# EAGLE design CHAIRI2CXIAO (EAGLE 9.6.2)

## Sheet 1 of 2
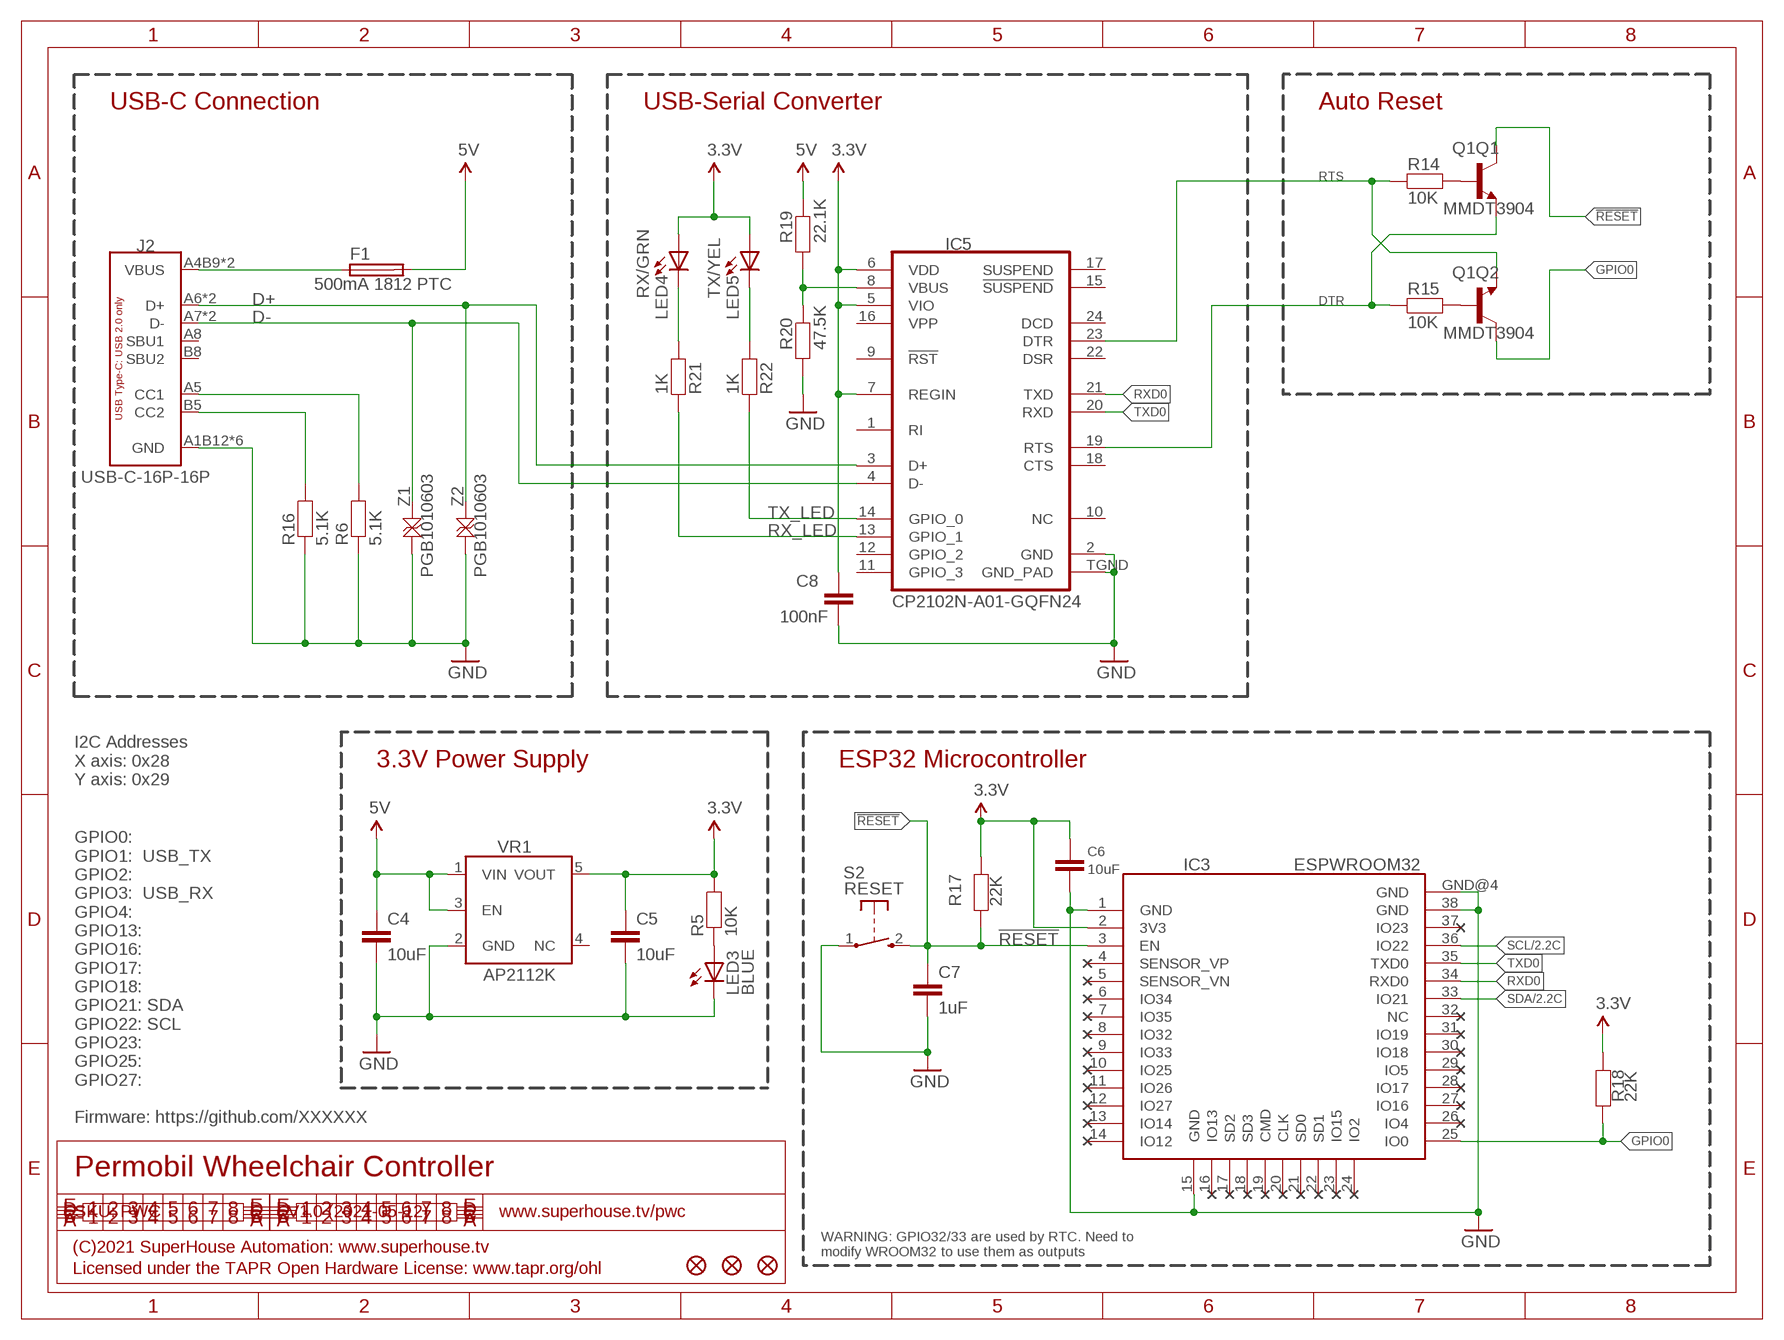
[diagram p0: schematic, sheet 1]

### Parts
C4  10uF  CAP0805  [C0805]
C5  10uF  CAP0805  [C0805]
C6  10uF  CAP0805  [C0805]
C7  1uF  CAP0603  [C0603]
C8  100nF  CAP0603  [C0603]
F1  500mA 1812 PTC  PTC050  [1812]
IC3  ESPWROOM32  [ESPWROOM32]
IC5  CP2102N-A01-GQFN24  CP2104  [QFN-24]
J2  USB-C-16P-16P  [USB-C-16P]
LED3  BLUE  LED0603  [LED-0603]
LED4  RX/GRN  LED0603  [LED-0603]
LED5  TX/YEL  LED0603  [LED-0603]
Q1  MMDT3904  TRANS_NPN_DUAL-MMDT3904  [SOT-363]
R5  10K  RESISTOR0603  [R0603]
R6  5.1K  RESISTOR0603  [R0603]
R14  10K  RESISTOR0603  [R0603]
R15  10K  RESISTOR0603  [R0603]
R16  5.1K  RESISTOR0603  [R0603]
R17  22K  RESISTOR0603  [R0603]
R18  22K  RESISTOR0603  [R0603]
R19  22.1K  RESISTOR0603  [R0603]
R20  47.5K  RESISTOR0603  [R0603]
R21  1K  RESISTOR0603  [R0603]
R22  1K  RESISTOR0603  [R0603]
S2  RESET  TAC_SWITCH_2PINSMT  [TACTILE_SMT_3X4X2]
U$35  FIDUCIAL1X2  [FIDUCIAL-1X2]
U$36  FIDUCIAL1X2  [FIDUCIAL-1X2]
U$37  FIDUCIAL1X2  [FIDUCIAL-1X2]
VR1  AP2112KSOT25  [SOT23-5]
Z1  PGB1010603  TVS0603  [TVS0603]
Z2  PGB1010603  TVS0603  [TVS0603]

### Nets
3.3V: C5.1 C6.1 C8.1 IC3.2(3V3) IC5.5(VIO) IC5.6(VDD) IC5.7(REGIN) LED4.A LED5.A R5.2 R17.1 R18.1 VR1.5(VOUT) ; also sheet 2
5V: C4.1 F1.2 R19.2 VR1.1(VIN) VR1.3(EN)
!RESET: C7.1 IC3.3(EN) Q1.3(Q1:C) R17.2 S2.2(S)
D+: IC5.3(D+) J2.A6(D+) J2.B6(D+) Z2.2
D-: IC5.4(D-) J2.A7(D-) J2.B7(D-) Z1.2
DTR: IC5.23(DTR) Q1.1(Q2:E) R14.1
GND: C4.2 C5.2 C6.2 C7.2 C8.2 IC3.1(GND) IC3.15(GND) IC3.38(GND) IC3.GND@4(GND) IC5.2(GND) IC5.TGND(GND_PAD) J2.A1B12(GND) J2.A12B1(GND) J2.FIX1(GND) J2.FIX2(GND) J2.FIX3(GND) J2.FIX4(GND) LED3.C R6.1 R16.1 R20.1 S2.1(P) VR1.2(GND) Z1.1 Z2.1 ; also sheet 2
GPIO0: IC3.25(IO0) Q1.6(Q2:C) R18.2
N$1: LED3.A R5.1
N$7: Q1.5(Q1:B) R14.2
N$8: Q1.2(Q2:B) R15.2
N$9: LED4.C R21.2
N$10: J2.B5(CC2) R16.2
N$11: J2.A5(CC1) R6.2
N$13: LED5.C R22.2
N$39: IC5.8(VBUS) R19.1 R20.2
RTS: IC5.19(RTS) Q1.4(Q1:E) R15.1
RX_LED: IC5.13(GPIO_1) R21.1
RXD0: IC3.34(RXD0) IC5.21(TXD)
SCL: IC3.36(IO22) ; also sheet 2
SDA: IC3.33(IO21) ; also sheet 2
TX_LED: IC5.14(GPIO_0) R22.1
TXD0: IC3.35(TXD0) IC5.20(RXD)
VIN: F1.1 J2.A4B9(VBUS) J2.A9B4(VBUS)
Unconnected: IC3.4(SENSOR_VP) IC3.5(SENSOR_VN) IC3.6(IO34) IC3.7(IO35) IC3.8(IO32) IC3.9(IO33) IC3.10(IO25) IC3.11(IO26) IC3.12(IO27) IC3.13(IO14) IC3.14(IO12) IC3.16(IO13) IC3.17(SD2) IC3.18(SD3) IC3.19(CMD) IC3.20(CLK) IC3.21(SD0) IC3.22(SD1) IC3.23(IO15) IC3.24(IO2) IC3.26(IO4) IC3.27(IO16) IC3.28(IO17) IC3.29(IO5) IC3.30(IO18) IC3.31(IO19) IC3.32(NC) IC3.37(IO23) IC5.1(RI) IC5.9(!RST) IC5.10(NC) IC5.11(GPIO_3) IC5.12(GPIO_2) IC5.15(!SUSPEND) IC5.16(VPP) IC5.17(SUSPEND) IC5.18(CTS) IC5.22(DSR) IC5.24(DCD) J2.A8(SBU1) J2.B8(SBU2) VR1.4(NC)

### Notes on the sheet
- USB-C Connection | USB-Serial Converter | Auto Reset
- 3.3V Power Supply | ESP32 Microcontroller
- I2C Addresses
  X axis: 0x28
  Y axis: 0x29
- GPIO0:  
  GPIO1:  USB_TX
  GPIO2:  
  GPIO3:  USB_RX
  GPIO4:  
  GPIO13: 
  GPIO16: 
  GPIO17: 
  GPIO18: 
  GPIO21: SDA
  GPIO22: SCL
  GPIO23: 
  GPIO25: 
  GPIO27: 
  
  Firmware: https://github.com/XXXXXX
- Permobil Wheelchair Controller
- SKU: PWC | V1.0 (2021-05-12) | www.superhouse.tv/pwc
- (C)2021 SuperHouse Automation: www.superhouse.tv
- WARNING: GPIO32/33 are used by RTC. Need to
  modify WROOM32 to use them as outputs
- Licensed under the TAPR Open Hardware License: www.tapr.org/ohl

## Sheet 2 of 2
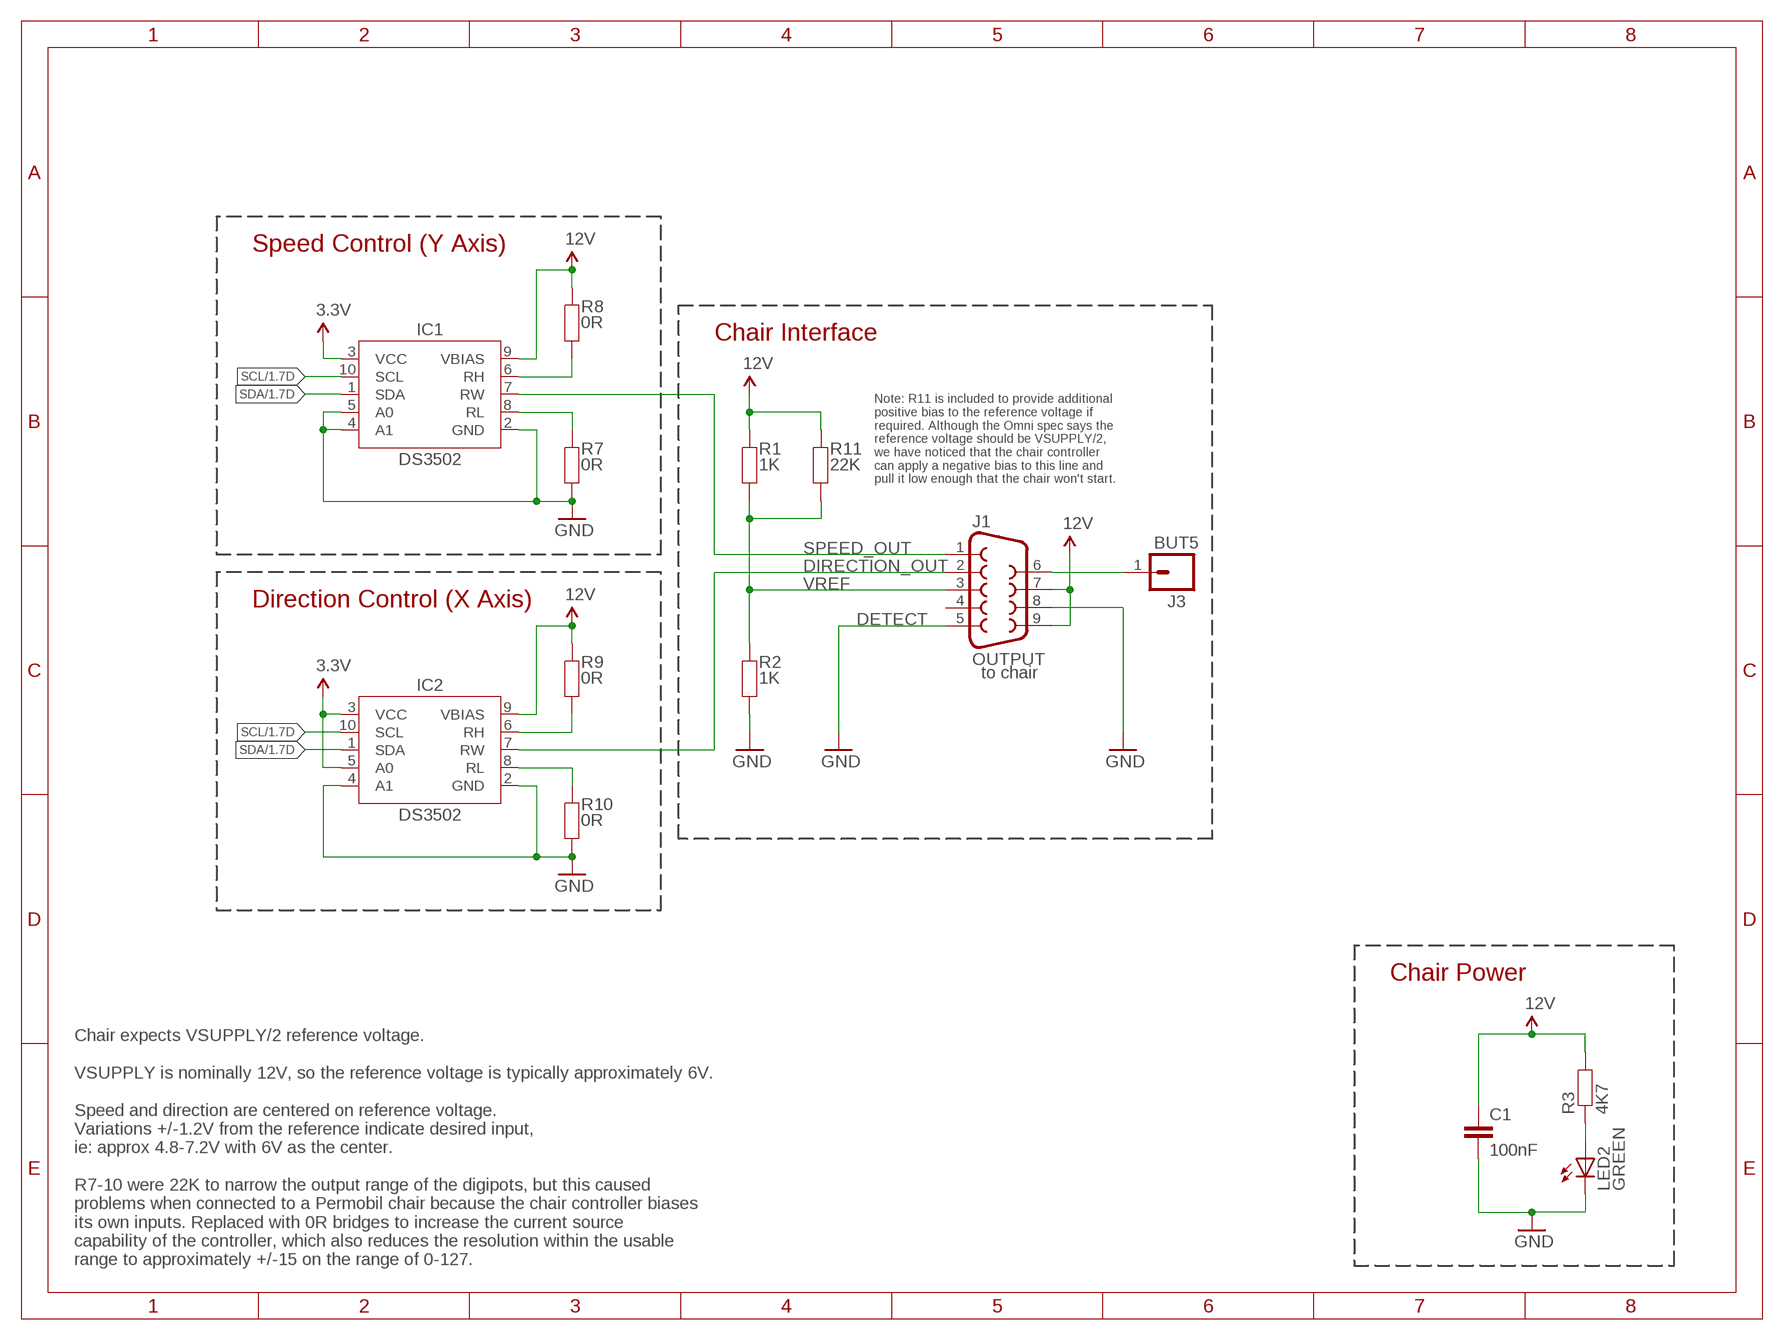
[diagram p1: schematic, sheet 2]

### Parts
C1  100nF  CAP0603  [C0603]
IC1  DS3502  [MSOP10]
IC2  DS3502  [MSOP10]
J1  OUTPUT  DB9-PCB-SOCKET  [DB9-PCB-SOCKET]
J3  BUT5  M01-PLAIN  [1X01]
LED2  GREEN  LED0603  [LED-0603]
R1  1K  RESISTOR0603  [R0603]
R2  1K  RESISTOR0603  [R0603]
R3  4K7  RESISTOR0603  [R0603]
R7  0R  RESISTOR0603  [R0603]
R8  0R  RESISTOR0603  [R0603]
R9  0R  RESISTOR0603  [R0603]
R10  0R  RESISTOR0603  [R0603]
R11  22K  RESISTOR0603  [R0603]

### Nets
3.3V: IC1.3(VCC) IC2.3(VCC) IC2.5(A0) ; also sheet 1
12V: C1.1 IC1.9(VBIAS) IC2.9(VBIAS) J1.7 J1.9 R1.2 R3.2 R8.2 R9.2 R11.2
BUT5: J1.6 J3.1
DIRECTION_OUT: IC2.7(RW) J1.2
GND: C1.2 IC1.2(GND) IC1.4(A1) IC1.5(A0) IC2.2(GND) IC2.4(A1) J1.5 J1.8 LED2.C R2.1 R7.1 R10.1 ; also sheet 1
N$2: IC1.6(RH) R8.1
N$3: IC2.6(RH) R9.1
N$4: IC1.8(RL) R7.2
N$6: LED2.A R3.1
N$15: IC2.8(RL) R10.2
SCL: IC1.10(SCL) IC2.10(SCL) ; also sheet 1
SDA: IC1.1(SDA) IC2.1(SDA) ; also sheet 1
SPEED_OUT: IC1.7(RW) J1.1
VREF: J1.3 R1.1 R2.2 R11.1
Unconnected: J1.4

### Notes on the sheet
- Speed Control (Y Axis)
- Chair Interface
- Note: R11 is included to provide additional
  positive bias to the reference voltage if
  required. Although the Omni spec says the
  reference voltage should be VSUPPLY/2,
  we have noticed that the chair controller
  can apply a negative bias to this line and
  pull it low enough that the chair won't start.
- Direction Control (X Axis)
- DETECT
- to chair
- Chair Power
- Chair expects VSUPPLY/2 reference voltage.
  
  VSUPPLY is nominally 12V, so the reference voltage is typically approximately 6V.
  
  Speed and direction are centered on reference voltage.
  Variations +/-1.2V from the reference indicate desired input,
  ie: approx 4.8-7.2V with 6V as the center.
  
  R7-10 were 22K to narrow the output range of the digipots, but this caused
  problems when connected to a Permobil chair because the chair controller biases
  its own inputs. Replaced with 0R bridges to increase the current source
  capability of the controller, which also reduces the resolution within the usable
  range to approximately +/-15 on the range of 0-127.

## Library data of the parts
C1 C4-C8 = SuperHouse-DiscreteSemi:CAP: Capacitor Standard ceramic capacitor
F1 = SuperHouse-Fuses:PTC: MF-SMDF Series - PRC Resettable Fuses Source: http://www.farnell.com/datasheets/716597.pdf
IC1 IC2 = SuperHouse-ICs:DS3502: DS3502 I2C digital potentiometer
IC3 = SuperHouse-MCUs:ESPWROOM32: Espressif WROOM32 ESP32 module
IC5 = SuperHouse-ICs:CP2104: CP2104 / CP2102N-A01-GQFN24 CP2104 USB to serial converter. The CP2104 is not recommended for new designs: replace with CP2102N-A01-GQFN24.
J1 = SuperHouse-Connectors:DB9: DB9 Connector
J2 = SuperHouse-Connectors:USB-C-16P: USB-C socket with 16 pins, suitable only for backward compatibility with USB 2
J3 = SuperHouse-Connectors:M01: 1-way header Standard 1x1 header
LED2-LED5 = SuperHouse-LEDs:LED: LEDs Standard schematic elements and footprints for 5mm, 3mm, 1206, and 0603 sized LEDs. 5mm - Spark Fun Electronics SKU : COM-00529 (and others)
Q1 = SuperHouse-DiscreteSemi:TRANS_NPN_DUAL: MMDT3904 Dual 3904 NPN transistors. Datasheet <http://www.onsemi.com/pub_link/Collateral/MBT3904DW1T1-D.PDF>; PROD_ID: TRANS-13337
R1-R3 R5-R11 R14-R22 = SuperHouse-DiscreteSemi:RESISTOR: Resistor Standard resistors.
S2 = SuperHouse-Switches:TAC_SWITCH_2PIN: Momentary Tactile Switch - 2 pin Uxcell 3x4x2mm switch with 2 SMT pads
U$35-U$37 = SuperHouse-Symbols:FIDUCIAL: Fiducial Alignment Points Various fiducial points for machine vision alignment.
VR1 = SuperHouse-Regulators:AP2112K: AP2112K LDO linear voltage regulator
Z1 Z2 = SuperHouse-DiscreteSemi:TVS: TVS voltage protection Zener

## Board
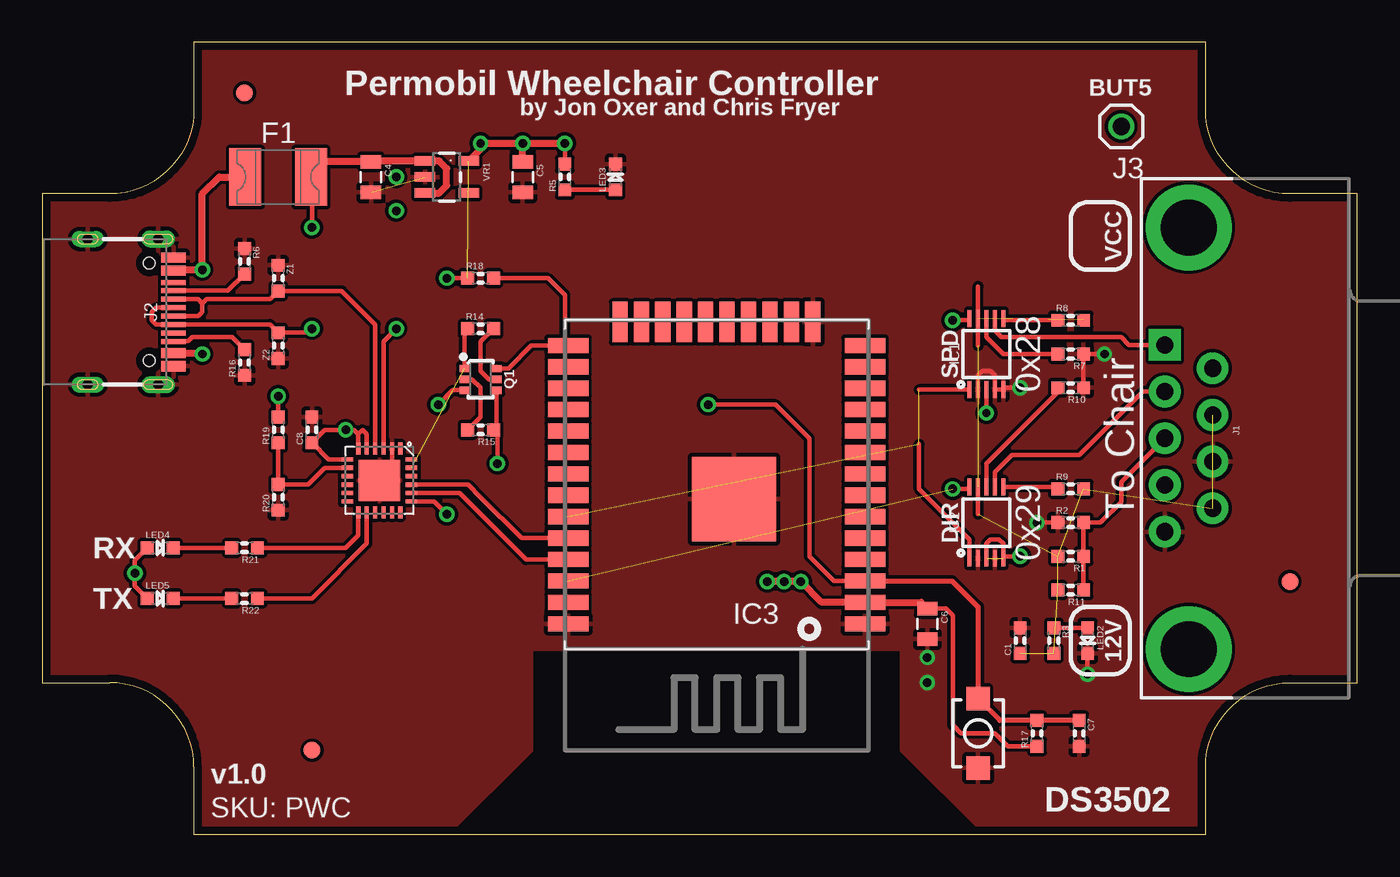
[diagram p2: board, top side]
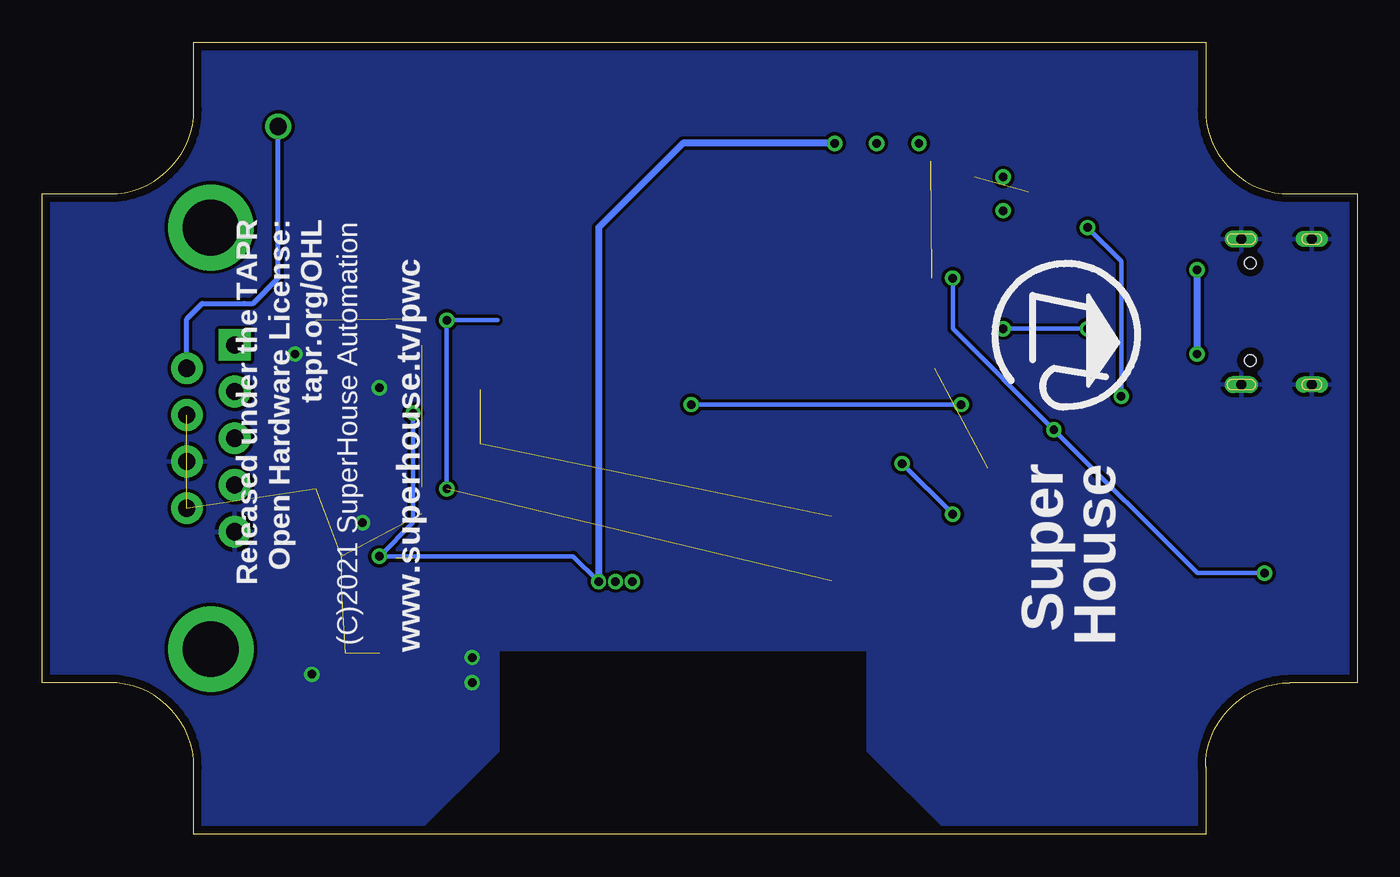
[diagram p3: board, bottom side, seen from below]

Size 78 x 47 mm. Coordinates in mm from the lower left corner, seen from the top.
Outline: 69,43 69,47 9,47 9,43 arc-90 4,38 0,38 0,9 4,9 arc-90 9,4 9,0 69,0 69,4 arc-90 74,9 78,9 78,38 74,38 arc-90 69,43
Copper layers (1*16): Top 0.035mm / dielectric 1.5mm / Bottom 0.035mm
Design rules "SuperHouse-Design-Rules": minimum track width 10mil, minimum drill 24mil, track to track 8mil, track to pad 8mil, pad to pad 8mil, via to via 8mil, smd to smd 6mil, copper to edge 18mil, drill to drill 8mil, minimum pad ring 7mil, minimum via ring 8mil, stop-mask expansion 4mil, vias tented up to drill 0.5mm, thermal gap 10mil

### Footprints (pad centres in the part's own frame; a part is rotated, then mirrored left to right if it is on the bottom)
C0603 = smd 0.762 x 0.762: 1 -0.762,0; 2 0.762,0
C0805 = smd 0.8 x 1.2: 1 -0.9,0; 2 0.9,0
1812 = smd 1.9 x 3.4: 1 -1.95,0; 2 1.95,0
MSOP10 = smd 1 x 0.25: 1 -2.113,1; 2 -2.113,0.5; 3 -2.113,0; 4 -2.113,-0.5; 5 -2.113,-1; 6 2.113,-1; 7 2.113,-0.5; 8 2.113,0; 9 2.113,0.5; 10 2.113,1
ESPWROOM32 = smd 2.4 x 0.9: 1 -8.8,-1.5; 2 -8.8,-2.77; 3 -8.8,-4.04; 4 -8.8,-5.31; 5 -8.8,-6.58; 6 -8.8,-7.85; 7 -8.8,-9.12; 8 -8.8,-10.39; 9 -8.8,-11.66; 10 -8.8,-12.93; 11 -8.8,-14.2; 12 -8.8,-15.47; 13 -8.8,-16.74; 14 -8.8,-18.01; 25 8.8,-18.01; 26 8.8,-16.74; 27 8.8,-15.47; 28 8.8,-14.2; 29 8.8,-12.93; 30 8.8,-11.66; 31 8.8,-10.39; 32 8.8,-9.12; 33 8.8,-7.85; 34 8.8,-6.58; 35 8.8,-5.31; 36 8.8,-4.04; 37 8.8,-2.77; 38 8.8,-1.5 | smd 0.9 x 2.4: 15 -5.7,-19.4; 16 -4.43,-19.4; 17 -3.16,-19.4; 18 -1.89,-19.4; 19 -0.62,-19.4; 20 0.65,-19.4; 21 1.92,-19.4; 22 3.19,-19.4; 23 4.46,-19.4; 24 5.73,-19.4 | smd 5 x 5: GND@4 -1.03,-8.89
QFN-24 = smd 0.25 x 0.7: 1 -1.25,-1.9; 2 -0.75,-1.9; 3 -0.25,-1.9; 4 0.25,-1.9; 5 0.75,-1.9; 6 1.25,-1.9; 13 1.25,1.9; 14 0.75,1.9; 15 0.25,1.9; 16 -0.25,1.9; 17 -0.75,1.9; 18 -1.25,1.9 | smd 0.7 x 0.25: 7 1.9,-1.25; 8 1.9,-0.75; 9 1.9,-0.25; 10 1.9,0.25; 11 1.9,0.75; 12 1.9,1.25; 19 -1.9,1.25; 20 -1.9,0.75; 21 -1.9,0.25; 22 -1.9,-0.25; 23 -1.9,-0.75; 24 -1.9,-1.25 | smd 2.45 x 2.45: TGND 0,0
DB9-PCB-SOCKET = drill 1.016 pad 1.88 square: 1 -5.54,-1.42 | drill 1.016 pad 1.88: 2 -2.77,-1.42; 3 0,-1.42; 4 2.77,-1.42; 5 5.54,-1.42; 6 -4.15,1.42; 7 -1.38,1.42; 8 1.38,1.42; 9 4.15,1.42 | drill 3.302 pad 5.08: G1 -12.5,0; G2 12.5,0
USB-C-16P = smd 0.6 x 1.45: A1B12 -3.225,5.095; A4B9 -2.45,5.095; A9B4 2.45,5.095; A12B1 3.225,5.095 | smd 0.3 x 1.45: A5 -1.25,5.095; A6 -0.25,5.095; A7 0.25,5.095; A8 1.25,5.095; B5 1.75,5.095; B6 0.75,5.095; B7 -0.75,5.095; B8 -1.75,5.095 | drill 0.6 pad 0.8 long: FIX1 -4.32,0; FIX4 4.32,0 | drill 0.6 pad 1 long: FIX2 -4.32,4.18; FIX3 4.32,4.18 | hole 0.65: 2.89,3.65; -2.89,3.65
1X01 = drill 1.016: 1 0,0
LED-0603 = smd 0.762 x 0.762: A -0.762,0; C 0.762,0
SOT-363 = smd 0.42 x 0.6: 1 -0.65,-0.95; 2 0,-0.95; 3 0.65,-0.95; 4 0.65,0.95; 5 0,0.95; 6 -0.65,0.95
R0603 = smd 0.762 x 0.762: 1 -0.762,0; 2 0.762,0
TACTILE_SMT_3X4X2 = smd 1.4 x 1.4: 1 -2.05,0; 2 2.05,0
FIDUCIAL-1X2 = smd 1 x 1: 1 0,0
SOT23-5 = smd 0.55 x 1.2: 1 -0.95,-1.3; 2 0,-1.3; 3 0.95,-1.3; 4 0.95,1.3; 5 -0.95,1.3
TVS0603 = smd 0.762 x 0.762: 1 -0.762,0; 2 0.762,0

### Placement (x,y rotation side)
C1  58,11.5 90 top
C4  19.5,39 270 top
C5  28.5,39 270 top
C6  52.5,12.5 270 top
C7  61.5,6 270 top
C8  16,24 90 top
F1  14,39 0 top
IC1  56,28.5 90 top
IC2  56,18.5 90 top
IC3  40,11 180 top
IC5  20,21 180 top
J1  68,23.5 270 top
J2  2.7,31 270 top
J3  64,42 180 top
LED2  62,11.5 270 top
LED3  34,39 90 top
LED4  7,17 0 top
LED5  7,14 0 top
Q1  26,27 270 top
R1  61,16.5 180 top
R2  61,18.5 0 top
R3  60,11.5 270 top
R5  31,39 90 top
R6  12,34 270 top
R7  61,28.5 180 top
R8  61,30.5 0 top
R9  61,20.5 0 top
R10  61,26.5 180 top
R11  61,14.5 180 top
R14  26,30 0 top
R15  26,24 180 top
R16  12,28 90 top
R17  59,6 90 top
R18  26,33 0 top
R19  14,24 90 top
R20  14,20 90 top
R21  12,17 180 top
R22  12,14 180 top
S2  55.5,6 90 top
U$35  12,44 0 top
U$36  16,5 0 top
U$37  74,15 0 top
VR1  24,39 270 top
Z1  14,33 270 top
Z2  14,29 90 top

### Tracks (layer width: path | path; a pad name or v marks a point on that pad's centre or on a via)
3.3V  (via drill 0.5)  (2 unrouted)
  Top 0.254: IC1.3 v56,25 | v58,16.5 57,16.5 57,17.25 56.75,17.5 56.25,17.5 56,17.25 IC2.3 | LED4.A 5.5,16.26 v5.5,15.5 5.5,14.74 LED5.A | IC5.5 19.25,23.75 19,24 18.75,23.75 | IC5.6 18.75,23.75 | IC5.7 16.99,22.25 C8.1 16.76,24 v18,24 18.5,24 18.75,23.75 | R17.1 57.26,5.24 56.5,6 54.5,6 54,6.5 54,13 53.6,13.4 C6.1 | R18.1 v24,33 | R5.2 v31,41
  Top 0.406: C6.1 52.13,13.77 IC3.2 46.23,13.77 v45,15 v44,15 v43,15 | VR1.5 26,40.65 v26,41 v28.5,41 | C5.1 v28.5,41 | v28.5,41 v31,41
  Bottom 0.254: v56,25 56,18.5 v58,16.5 46.5,16.5 v45,15 | v5.5,15.5 9.5,15.5 v18,24 24,30 v24,33
  Bottom 0.406: v31,41 40,41 45,36 v45,15
5V  (via drill 0.5)
  Top 0.254: R19.2 v14,26 | v16,36 16,38.95 F1.2
  Top 0.406: F1.2 15.95,39.95 16,40 16.1,39.9 C4.1 19.55,39.95 VR1.1 23.55,39.95 24,39.5 24,38.5 23.55,38.05 VR1.3
  Bottom 0.254: v16,36 14,34 v14,26
12V  (9 unrouted)
  Top 0.254: 55.5,32.5 IC1.9 55.5,29 | IC2.9 55.5,19
!RESET  (via drill 0.5)
  Top 0.254: IC3.3 46.96,15.04 45.5,16.5 45.5,23.5 43.5,25.5 v39.5,25.5 | v23.5,25.5 24.35,26.35 Q1.3
  Top 0.305: C7.1 R17.2 56.79,6.76 S2.2 55.5,13.5 53.96,15.04 IC3.3
  Bottom 0.254: v39.5,25.5 v23.5,25.5
BUT5
  Bottom 0.305: J1.6 69.42,30.58 68.5,31.5 66,31.5 65.5,31.5 64,33 J3.1
D+  (via drill 0.5)
  Top 0.254: J2.A6 6.75,31.25 6.5,31 6.5,30.5 6.75,30.25 J2.B6 13.51,30.25 Z2.2 15.76,29.76 v16,30 | IC5.3 20.25,29.25 v21,30
  Bottom 0.254: v21,30 v16,30
D-
  Top 0.254: J2.A7 9.25,30.75 9.5,31 9.5,31.5 | J2.B7 9.25,31.75 9.5,31.5 | 9.5,31.5 9.75,31.75 13.51,31.75 Z1.2 17.76,32.24 19.75,30.25 IC5.4
DIRECTION_OUT
  Top 0.254: J1.2 65.27,26.27 61.5,22.5 57.5,22.5 56.5,21.5 IC2.7
DTR  (1 unrouted)
  Top 0.254: Q1.1 25.05,29.81 R14.1
GND  (via drill 0.5)  (1 unrouted)
  Top 0.254: R2.1 v59,18.5 | LED2.C v62,9.5 | v63,28.5 R7.1 R10.1 | v58,26.5 57.11,26.5 IC1.5 IC1.4 56.5,27.25 56.25,27.5 55.75,27.5 55.5,27.25 IC1.2 | IC5.2 20.75,21.75 IC5.TGND
  other vias: 52.5,10.5 52.5,9
  pour Bottom: 69,43.02 arc90 74,38.02 78,38.02 78,9 74,9 arc90 69,4 69,0 56,0 51,5 51,11 29,11 29,5 24,0 9,0 9,4 arc90 4,9 0,9 0,38 4,38 arc90 9,43 9,47.02 69,47
  pour Top: 4,38 arc90 9,43 9,47.02 69,47 69,43.02 arc90 74,38.02 78,38.02 78,9 74,9 arc90 69,4 69,0 56,0 51,5 51,11 29,11 29,5 24,0 9,0 9,4 arc90 4,9 0,9 0,38
GPIO0
  Top 0.254: Q1.6 27.65,27.65 29,29 IC3.25 31,29.21 31,32 30,33 R18.2
N$1
  Top 0.254: R5.1 LED3.A
N$2
  Top 0.254: R8.1 57.11,30.5 IC1.6
N$3
  Top 0.254: R9.1 60.12,20.61 IC2.6
N$4
  Top 0.254: R7.2 57,28.5 56,29.5 IC1.8
N$5  (via drill 0.5)
  other vias: 21,39
N$6
  Top 0.254: LED2.A R3.1
N$7
  Top 0.254: Q1.5 26.5,27 26,27.5 26,29.24 R14.2
N$8
  Top 0.254: Q1.2 25.5,27 26,26.5 26,24.76 R15.2
N$9
  Top 0.254: LED4.C R21.2
N$10
  Top 0.254: J2.B5 7.82,29.27 8.66,29.27 8.89,29.5 11.26,29.5 R16.2
N$11
  Top 0.254: J2.A5 11.01,32.25 R6.2
N$12  (via drill 0.5)
  other vias: 21,37
N$13
  Top 0.254: LED5.C R22.2
N$15
  Top 0.254: R10.2 60.24,26.24 56,22 IC2.8
N$39
  Top 0.254: R19.1 R20.2 15.76,20.76 16.75,21.75 IC5.8
RTS  (via drill 0.5)
  Top 0.254: Q1.4 26.95,24.19 R15.1 27,23.76 v27,22 | IC5.19 23.25,19.75 v24,19
  Bottom 0.254: v24,19 v27,22
RX_LED
  Top 0.254: R21.1 18,17 18.75,17.75 IC5.13
RXD0
  Top 0.254: IC3.34 28.42,17.58 26,20 25.25,20.75 IC5.21
SCL  (via drill 0.5)  (1 unrouted)
  Top 0.254: IC2.10 54.89,20.5 v54,20.5 | IC1.10 54.89,30.5 v54,30.5
  Bottom 0.254: 51,30.5 v54,30.5 v54,20.5
SDA  (2 unrouted)
  Top 0.254: IC1.1 52,26.39 | IC2.1 55,17.5 52,20.5 52,23.15
SPEED_OUT
  Top 0.254: J1.1 64.46,29.04 64,29.5 56.88,29.5 56.5,29.88 IC1.7
TX_LED
  Top 0.254: R22.1 16,14 19.25,17.25 IC5.14
TXD0
  Top 0.254: IC3.35 28.69,16.31 26,19 24.75,20.25 IC5.20
VIN  (via drill 0.5)
  Top 0.406: J2.A4B9 7.84,33.5 v9.5,33.5 9.5,38 10.5,39 F1.1 | J2.A9B4 9.45,28.55 v9.5,28.5
  Bottom 0.406: v9.5,28.5 v9.5,33.5
VREF
  Top 0.254: J1.3 64,20.92 64,19.74 62.76,18.5 R2.2 R1.1 R11.1

### Text on the board
tPlace: Permobil Wheelchair Controller | BUT5 | by Jon Oxer and Chris Fryer | VCC | SPD | 0x28 | To Chair | DIR | 0x29 | RX | TX | 12V | v1.0 | SKU: PWC | DS3502
bPlace: (C)2021 SuperHouse Automation | Released under the TAPR / Open Hardware License: / tapr.org/OHL | Super / House | www.superhouse.tv/pwc